# EasyEDA Pro project stm32_smart_teach.eprj

# Schematic Schematic1
Create Date: 2024-07-12; Page Name: P1; Project Name: stm32_smart_teach; Schematic Name: Schematic1; Update Date: 2024-07-14; Company: 嘉立创EDA; Page Size: A4; Version: V1.0
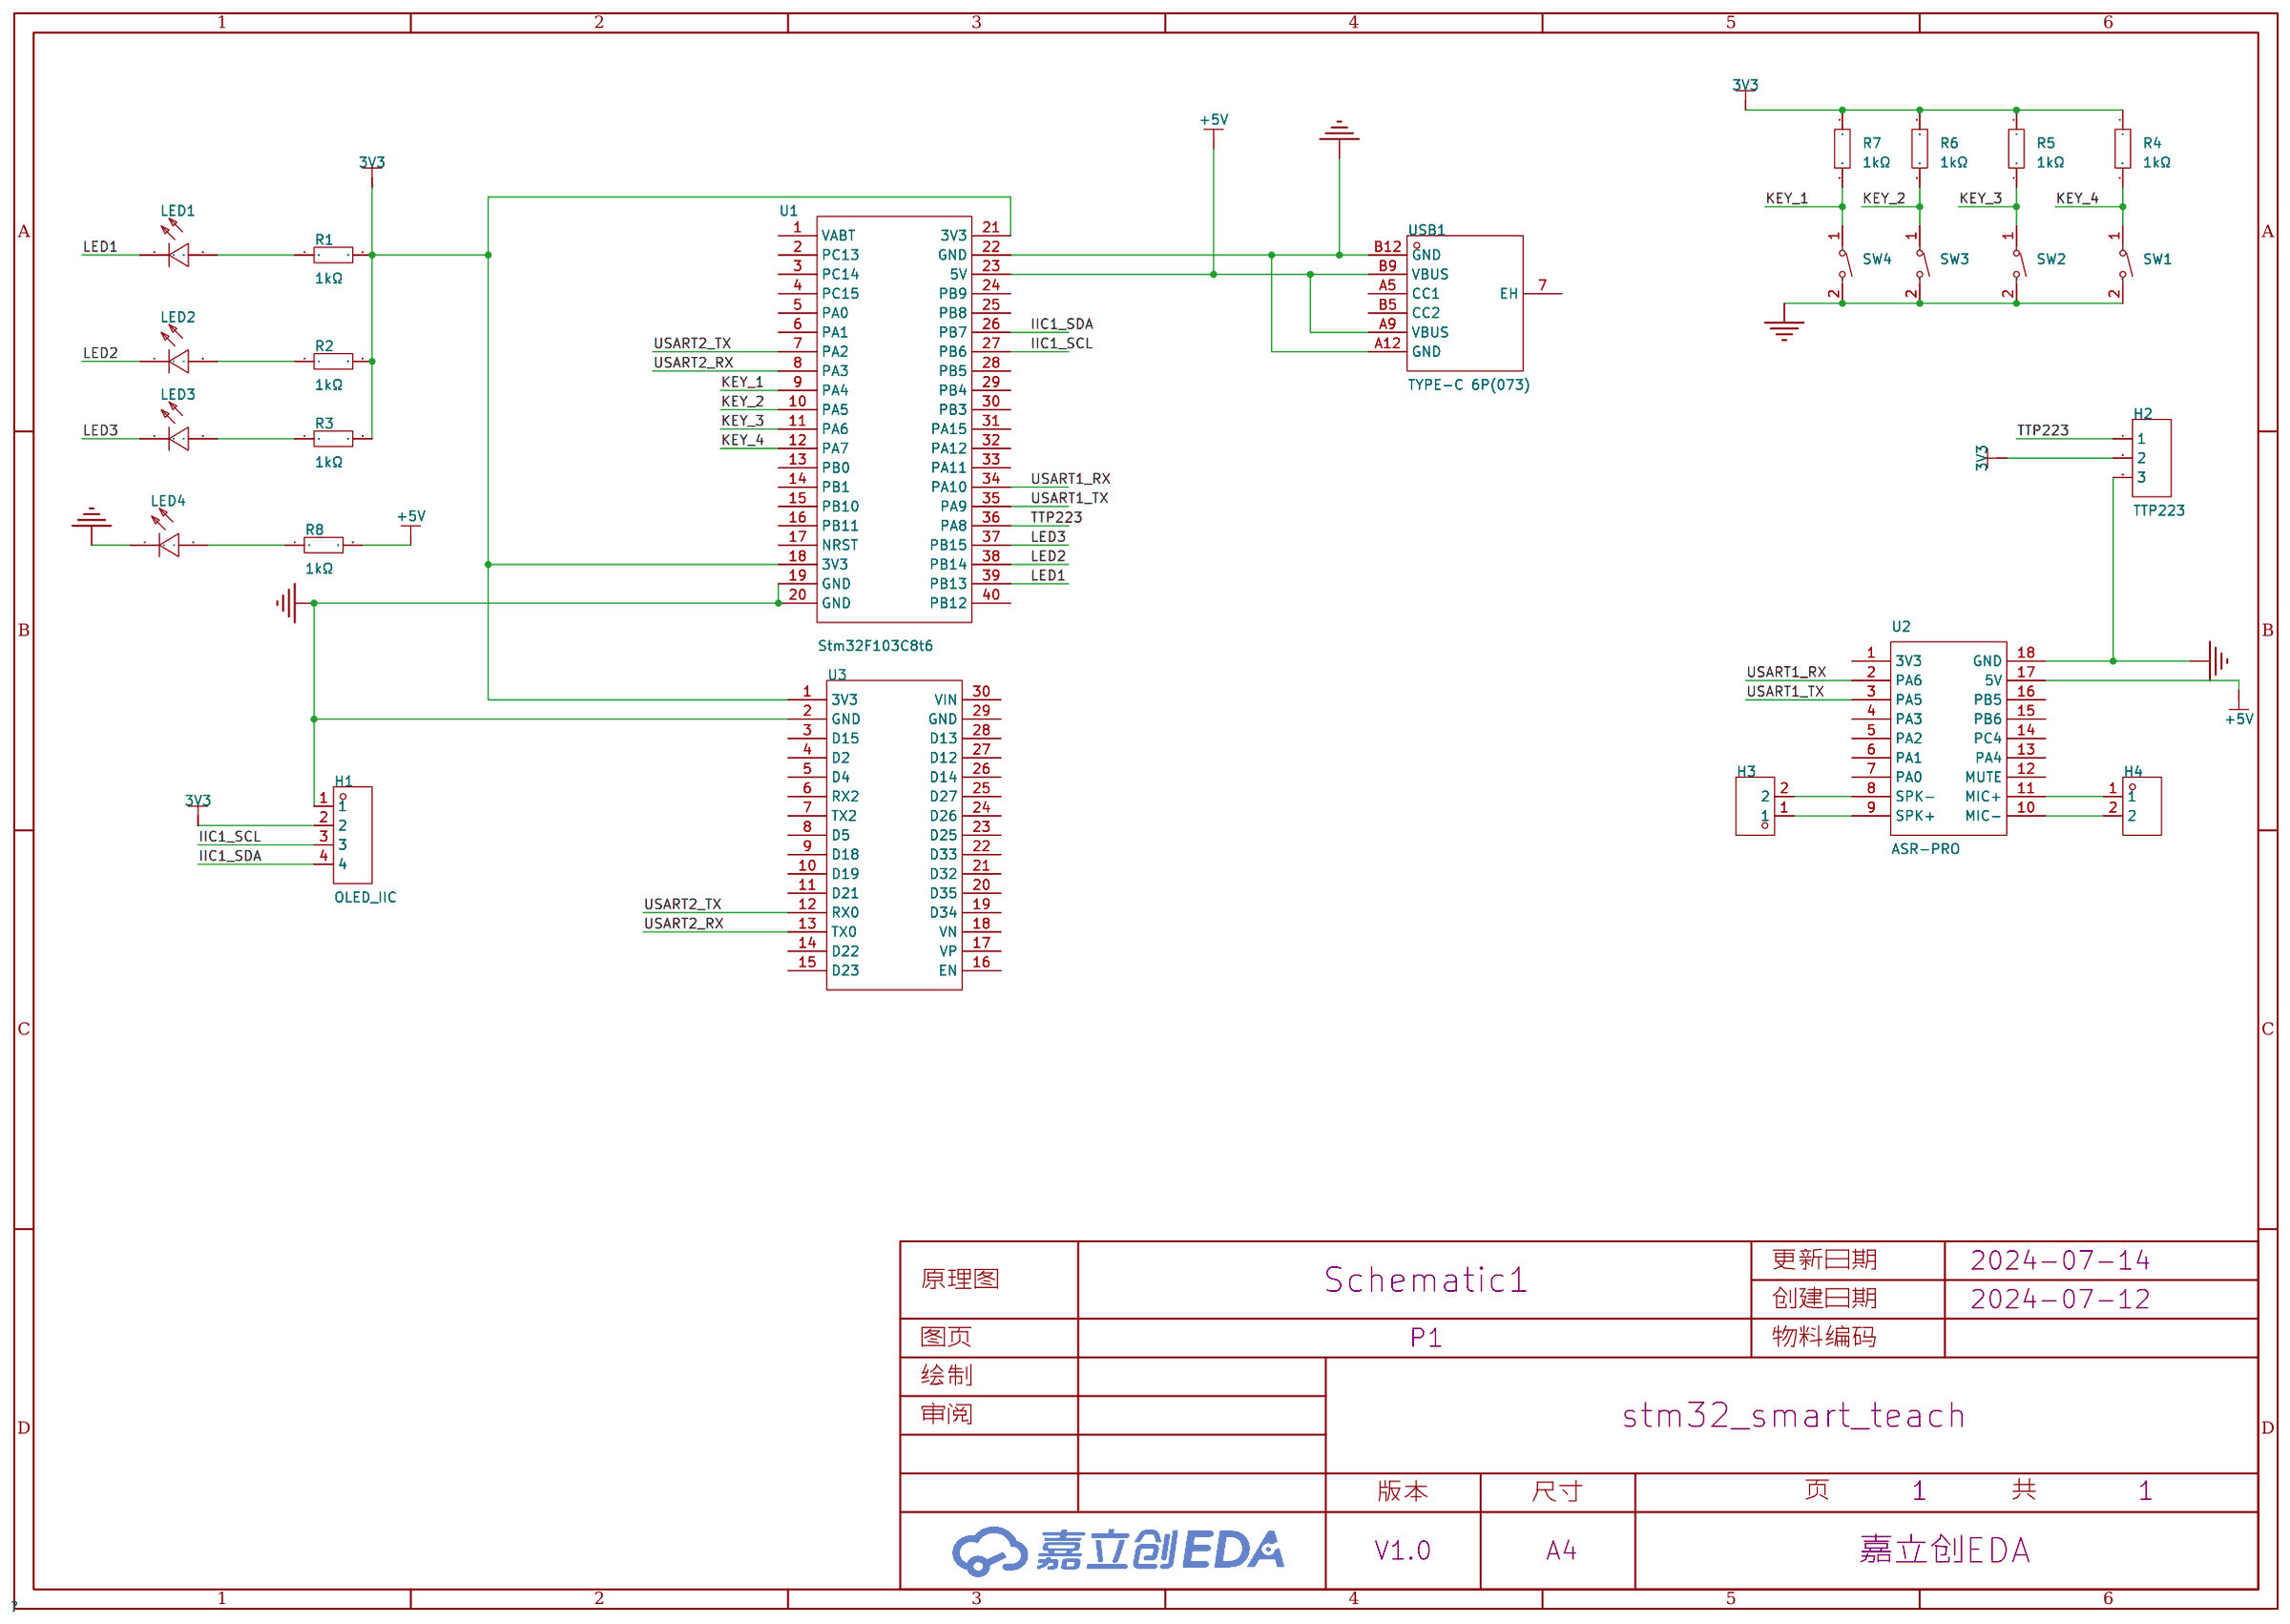
[diagram p0: schematic sheet]

## Parts
H1  OLED_IIC  [HDR-TH_4P-P2.54-V-F]
H2  TTP223  [HDR-TH_3P-P2.54-V-M-1]
H3  PZ254V-11-02P  [HDR-TH_2P-P2.54-V-M]
H4  PZ254V-11-02P  [HDR-TH_2P-P2.54-V-M]
LED1  NCD0603R1  [LED0603-RD_RED]
LED2  NCD0603R1  [LED0603-RD_RED]
LED3  NCD0603R1  [LED0603-RD]
LED4  NCD0603R1  [LED0603-RD_RED]
R1  1kΩ  [R0603]
R2  1kΩ  [R0603]
R3  1kΩ  [R0603]
R4  1kΩ  [R0603]
R5  1kΩ  [R0603]
R6  1kΩ  [R0603]
R7  1kΩ  [R0603]
R8  1kΩ  [R0603]
SW1  GT-TC060A-H025-L1S  [SW-SMD_L6.1-W3.5-LS8.0]
SW2  GT-TC060A-H025-L1S  [SW-SMD_L6.1-W3.5-LS8.0]
SW3  GT-TC060A-H025-L1S  [SW-SMD_L6.1-W3.5-LS8.0]
SW4  GT-TC060A-H025-L1S  [SW-SMD_L6.1-W3.5-LS8.0]
U1  Stm32F103C8t6  [STM32]
U2  ASR-PRO  [ASR_PRO]
U3  -  [ESP32]
USB1  TYPE-C 6P(073)  [TYPE-C-SMD_TYPE-C-6P]

## Library data of the parts
H1 = 2.54-1*4P母: 插孔结构:1x4P;间距:2.54mm;行距:-;圆孔/方孔:方孔;安装类型:直插;排数:单排;总孔位数:4P;额定电流:3A;额定电压:-;插孔方向:顶部;塑高:-;触头材质:青铜;触头镀层:-;工作温度范围:-40℃~+105℃;焊接温度(最大值):-;; LCSC Part Name: 间距:2.54mm 1x4P 直插; Supplier Part: C2718488; Manufacturer: BOOMELE(博穆精密); Supplier Footprint: 插件,P=2.54mm; JLCPCB Part Class: 扩展库; Datasheet: https://atta.szlcsc.com/upload/public/pdf/source/20210301/C2718488_F4427B881E42CAA8DDB0B1C12B3A522C.pdf; Supplier: LCSC; Holes Structure: 1x4P; Pitch: 2.54mm; Circular Hole / Square Hole: 方孔; Mounting Type: 直插; Number of Rows: 单排; Number of Holes: 4P; Current Rating (Max): 3A; Holes Direction: 顶部; Contact Material: 青铜; Operating Temperature Range: -40℃~+105℃
H2 = 2.54-1*3P针: 插针结构:1x3P;间距:2.54mm;行距:-;圆针/方针:方针;安装类型:直插;排数:单排;总PIN位数:3P;额定电流:3A;额定电压:-;配合针长度:-;塑高:-;端接针长度:-;触头材质:-;触头镀层:-;工作温度范围:-40℃~+105℃;颜色:黑色;; LCSC Part Name: 间距:2.54mm 1x3P 直插 方针; Supplier Part: C49257; Manufacturer: BOOMELE(博穆精密); Supplier Footprint: 插件,P=2.54mm; JLCPCB Part Class: 扩展库; Datasheet: https://atta.szlcsc.com/upload/public/pdf/source/20221018/3E9408392E35E6F57A28985E5F7BF5C9.pdf; Supplier: LCSC; Pin Structure: 1x3P; Pitch: 2.54mm; Circluar Pins/Square Pins: 方针; Mounting Type: 直插; Number of Rows: 单排; Number of Pins: 3P; Current Rating (Max): 3A; Operating Temperature Range: -40℃~+105℃; Color: 黑色
H3 H4 = PZ254V-11-02P: 插针结构:1x2P;间距:2.54mm;行距:-;圆针/方针:方针;安装类型:直插;排数:单排;总PIN位数:2P;额定电流:-;额定电压:-;配合针长度:6mm;塑高:2.5mm;端接针长度:3mm;触头材质:黄铜;触头镀层:-;工作温度范围:-40℃~+105℃;颜色:黑色;; LCSC Part Name: 间距:2.54mm 1x2P 直插 方针; Supplier Part: C492401; Manufacturer: XFCN(兴飞); Supplier Footprint: 插件,P=2.54mm; JLCPCB Part Class: 扩展库; Datasheet: https://atta.szlcsc.com/upload/public/pdf/source/20200309/C492401_A812433581A9B211A7FFA413ADDFF0E5.pdf; Supplier: LCSC; Pin Structure: 1x2P; Pitch: 2.54mm; Circluar Pins/Square Pins: 方针; Mounting Type: 直插; Number of Rows: 单排; Number of Pins: 2P; Length of Mating Pin: 6mm; Insulation Height: 2.5mm; Length of End Connection Pin: 3mm; Contact Material: 黄铜; Operating Temperature Range: -40℃~+105℃; Color: 黑色
LED1-LED4 = NCD0603R1_C84263: 灯头类型:-;发光颜色:红色;正向电压(VF):1.6V~2.6V;功率:65mW;正向电流:20mA;主波长:615nm~630nm;二极管配置:独立二极管;透镜颜色:无色透明透镜;色温:-;发光强度:80mcd~220mcd;发光角度:130°;载带方式:-;工作温度:-30℃~+85℃;; Supplier Part: C84263; Manufacturer: 国星光电; Supplier Footprint: 0603; JLCPCB Part Class: 扩展库; Datasheet: https://atta.szlcsc.com/upload/public/pdf/source/20200820/C84263_DABC6A75E58F576973B407FDBA283D60.pdf; Supplier: LCSC; Emitted Color: 红色; Forward Voltage (VF): 1.6V~2.6V; Power Dissipation: 65mW; Forward Current: 20mA; Dominant Wavelength: 615nm~630nm; Diode Configuration: 独立二极管; Lens Color: 无色透明透镜; Luminous Intensity: 80mcd~220mcd; Viewing Angle: 130°; Operating Temperature: -30℃~+85℃
R1-R8 = 0603WAF1001T5E: 电阻类型:厚膜电阻;阻值:1kΩ;精度:±1%;功率:100mW;最大工作电压:75V;温度系数:±100ppm/℃;; LCSC Part Name: 1kΩ ±1% 100mW 厚膜电阻; Supplier Part: C21190; Manufacturer: UNI-ROYAL(厚声); Supplier Footprint: 0603; JLCPCB Part Class: 基础库; Datasheet: https://atta.szlcsc.com/upload/public/pdf/source/20200306/C422600_1E6D84923E4A46A82E41ADD87F860B5C.pdf; Supplier: LCSC; Type: 厚膜电阻; Tolerance: ±1%; Power(Watts): 100mW; Overload Voltage (Max): 75V; Temperature Coefficient: ±100ppm/℃; Operating Temperature Range: -55℃~+155℃
SW1-SW4 = GT-TC060A-H025-L1S: 电路结构:单刀单掷;作用力:1.6N;安装方式:立贴;带支架:不带;触点电流:50mA;额定电压(AC):12V;额定电压(DC):12V;绝缘电阻:100MΩ;带灯:无;机械寿命:10万次;; LCSC Part Name: 3×6×2.5 立贴 无声轻触开关; Supplier Part: C7450623; Manufacturer: G-Switch(品赞); Supplier Footprint: SMD,3x6mm; JLCPCB Part Class: 扩展库; Datasheet: https://atta.szlcsc.com/upload/public/pdf/source/20230712/3FF422A4BEDB42853830040444FDF292.pdf; Supplier: LCSC; Circuit: 单刀单掷; Operating Force: 1.6N; Mounting Style: 立贴; Strike Gundam: 不带; Contact Current: 50mA; Voltage Rating (AC): 12V; Voltage Rating (DC): 12V; Insulation Resistance: 100MΩ; With Lamp: 无; Mechanical Life: 10万次
U1 = stm32f103c8t6
U2 = ASR-PRO
U3 = esp32
USB1 = TYPE-C 6P(073): 连接器类型:Type-C;标准:-;公母:母;端口数量:1;触点数量:6P;安装方式:卧贴;额定电流 - 电源:5A;工作温度范围:-25℃~+85℃;; LCSC Part Name: Type-C 母 卧贴; Supplier Part: C668623; Manufacturer: SHOU HAN(首韩); Supplier Footprint: SMD; JLCPCB Part Class: 扩展库; Datasheet: https://atta.szlcsc.com/upload/public/pdf/source/20200618/C668623_A4B260DED7AC1949BAC6AE39E9F4CD80.pdf; Supplier: LCSC; Connector Type: Type-C; Gender: 母; Number of Ports: 1; Number of Contacts: 6P; Mounting Style: 卧贴; Current Rating - Power (Max): 5A; Operating Temperature Range: -25℃~+85℃

## Nets
3V3: H1.2 H2.2 R1.2 R2.2 R3.2 R4.1 R5.1 R6.1 R7.1 U1.18(3V3) U1.21(3V3) U3.1(3V3)
+5V: R8.2 U1.23(5V) U2.17(5V) USB1.A9(VBUS) USB1.B9(VBUS)
GND: H1.1 H2.3 LED4.1(K) SW1.2 SW2.2 SW3.2 SW4.2 U1.19(GND) U1.20(GND) U1.22(GND) U2.18(GND) U3.2(GND) USB1.A12(GND) USB1.B12(GND)
IIC1_SCL: H1.3 U1.27(PB6)
IIC1_SDA: H1.4 U1.26(PB7)
KEY_1: R7.2 SW4.1 U1.9(PA4)
KEY_2: R6.2 SW3.1 U1.10(PA5)
KEY_3: R5.2 SW2.1 U1.11(PA6)
KEY_4: R4.2 SW1.1 U1.12(PA7)
LED1: LED1.1(K) U1.39(PB13)
LED2: LED2.1(K) U1.38(PB14)
LED3: LED3.1(K) U1.37(PB15)
TTP223: H2.1 U1.36(PA8)
USART1_RX: U1.34(PA10) U2.2(PA6)
USART1_TX: U1.35(PA9) U2.3(PA5)
USART2_RX: U1.8(PA3) U3.13(TX0)
USART2_TX: U1.7(PA2) U3.12(RX0)
$1N2467: LED3.2(A) R3.1
$1N2473: LED2.2(A) R2.1
$1N2476: LED1.2(A) R1.1
$1N2645: LED4.2(A) R8.1
$1N3437: H4.2 U2.10(MIC-)
$1N3440: H4.1 U2.11(MIC+)
$1N3443: H3.1 U2.9(SPK+)
$1N3451: H3.2 U2.8(SPK-)

Not connected (* = marked no-connect by the designer): U1 1(VABT) 2(PC13) 3(PC14) 4(PC15) 5(PA0) 6(PA1) 13(PB0) 14(PB1) 15(PB10) 16(PB11) 17(NRST) 24(PB9) 25(PB8) 28(PB5) 29(PB4) 30(PB3) 31(PA15) 32(PA12) 33(PA11) 40(PB12); U2 1(3V3) 4(PA3) 5(PA2) 6(PA1) 7(PA0) 12(MUTE) 13(PA4) 14(PC4) 15(PB6) 16(PB5); U3 3(D15) 4(D2) 5(D4) 6(RX2) 7(TX2) 8(D5) 9(D18) 10(D19) 11(D21) 14(D22) 15(D23) 16(EN) 17(VP) 18(VN) 19(D34) 20(D35) 21(D32) 22(D33) 23(D25) 24(D26) 25(D27) 26(D14) 27(D12) 28(D13) 29(GND) 30(VIN); USB1 7(EH) A5(CC1) B5(CC2)

# Board PCB1
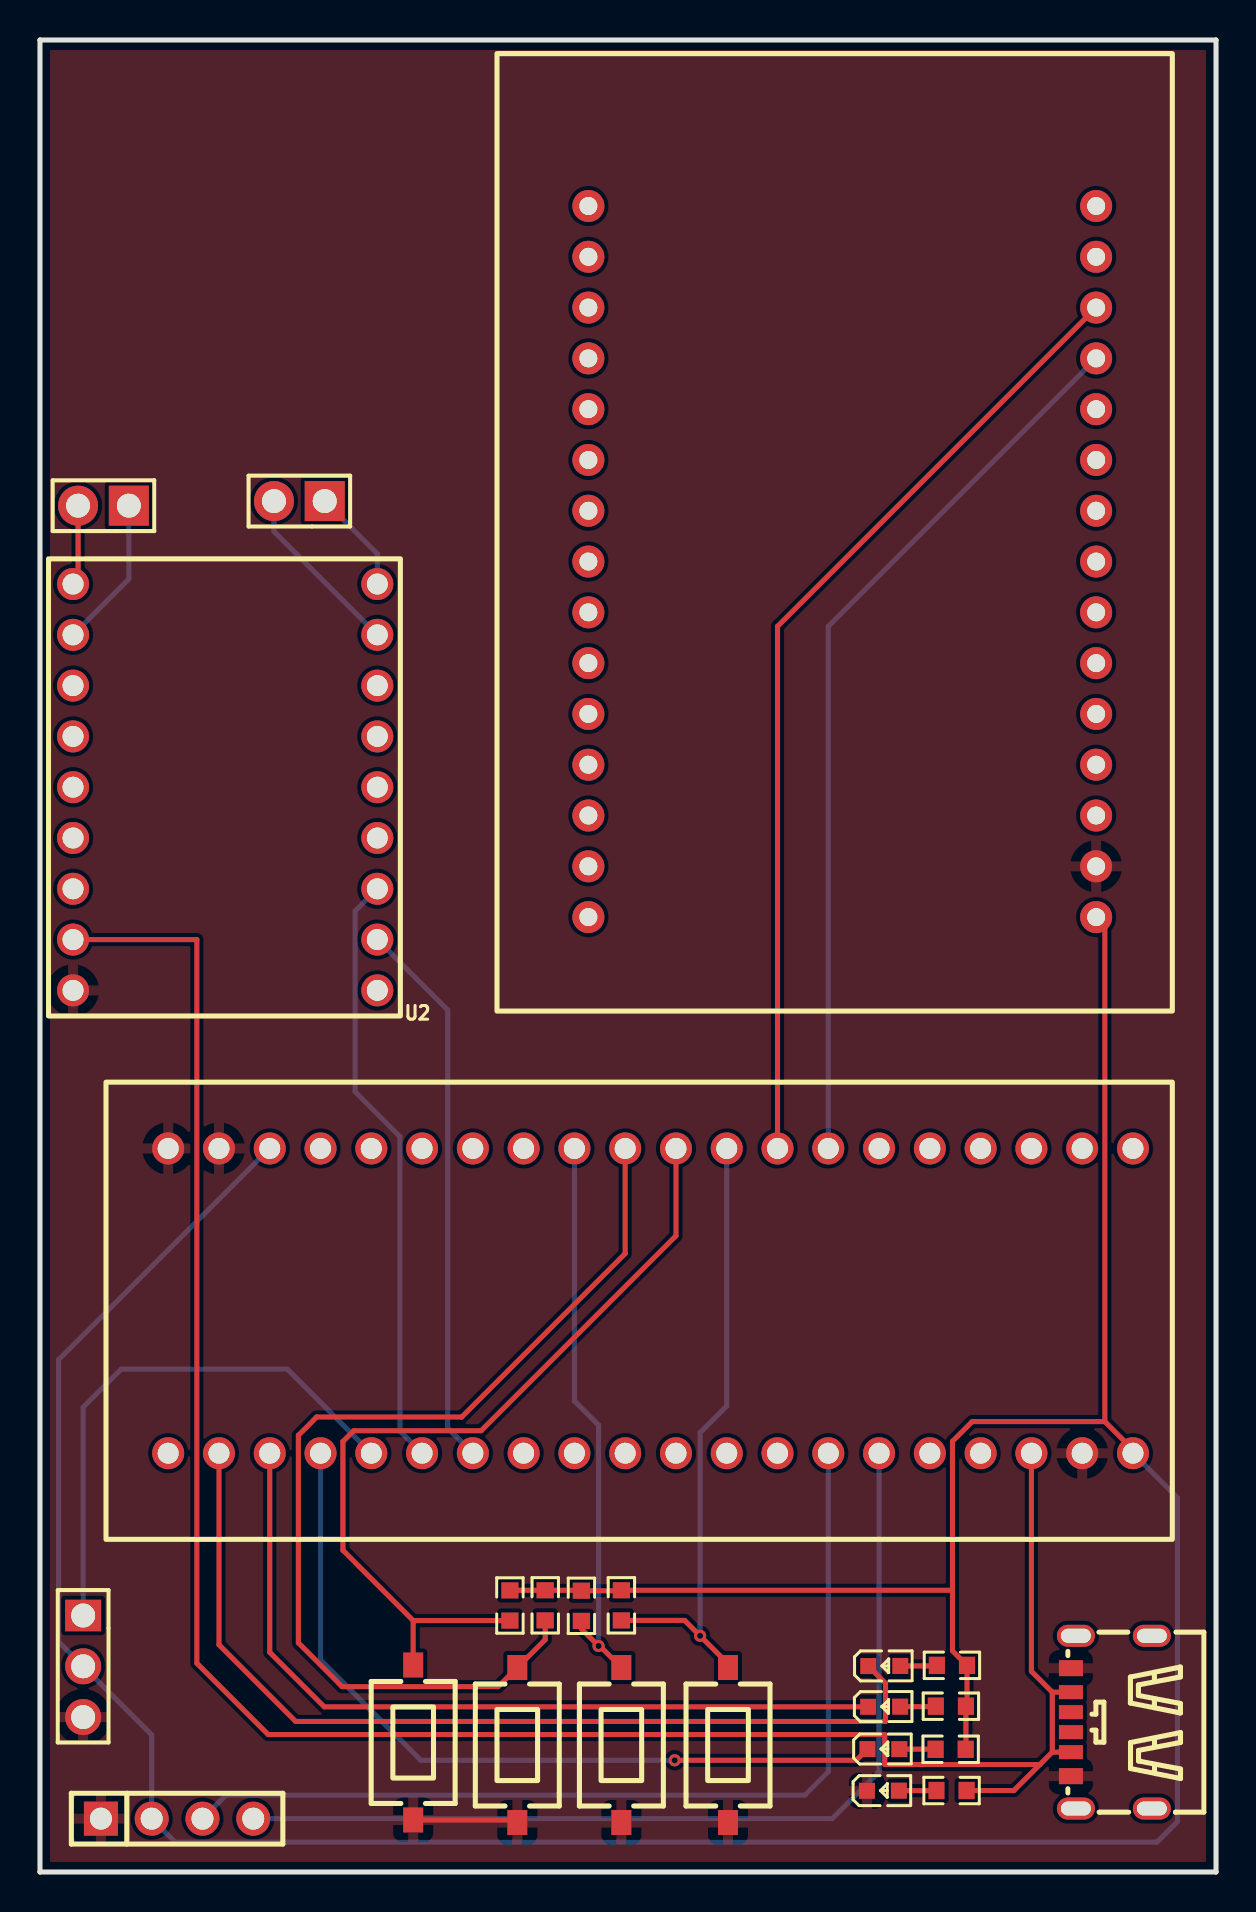
[diagram p1: board, top side]
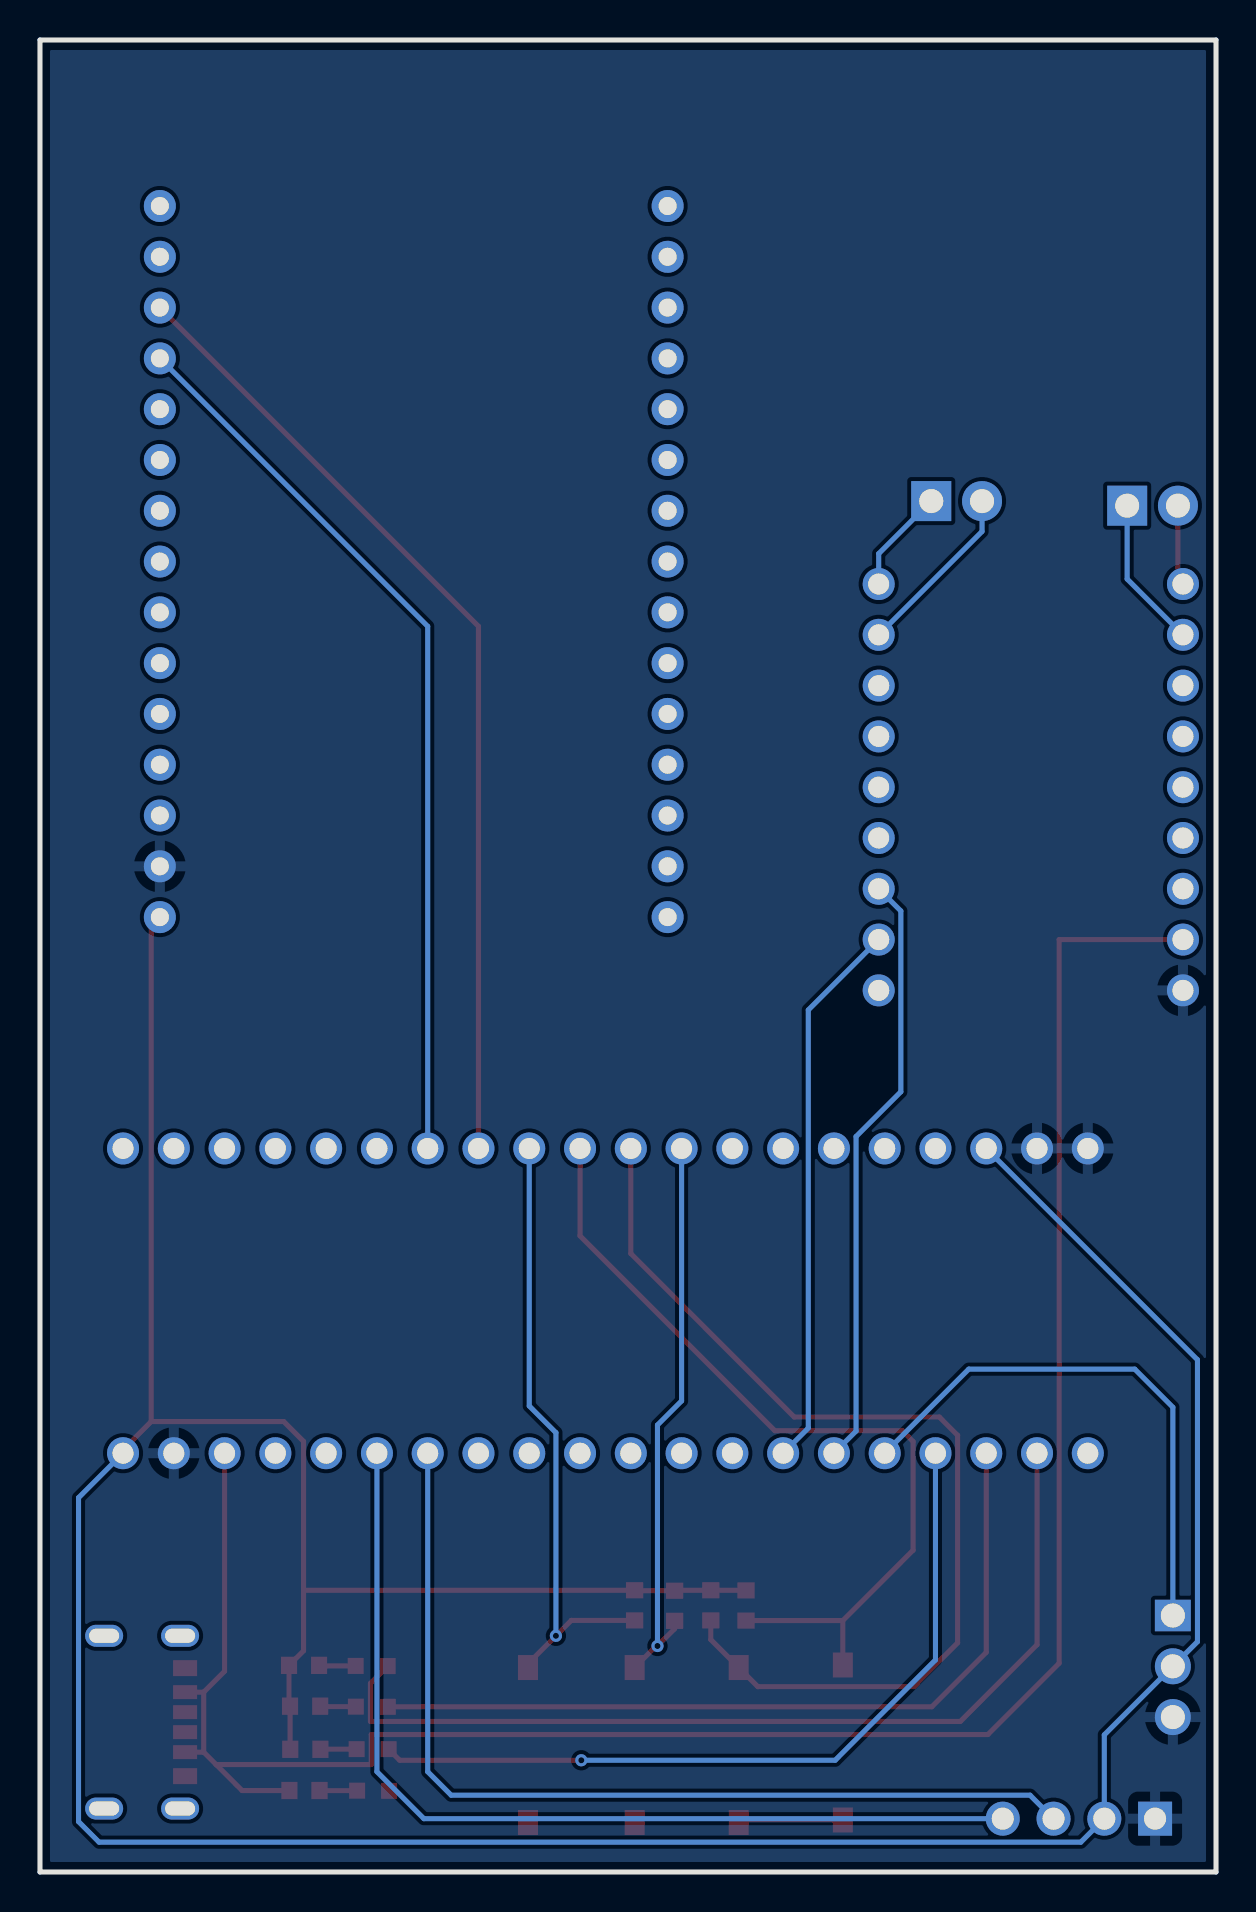
[diagram p2: board, bottom side, seen from below]

Outline 58.83 x 91.61 mm; copper layers: Top Layer, Bottom Layer. Coordinates in mm from the lower left corner of the outline.
Outline path: 0,91.61 58.83,91.61 58.83,0 0,0 0,91.61
Stack: Top Layer 0.035mm / Dielectric1 1.51mm FR4 er 4.5 / Bottom Layer 0.035mm

## Design rules (mm)
template: JLCPCB Capability(Two Layers Board)
spacing copperThickness1oz (default): track to track 0.102, other pairs 0.152 to 0.3
spacing copperThickness2oz: track to track 0.203, other pairs 0.152 to 0.3
track width copperThickness1oz (default): min 0.127, default 0.254, max 2.54
track width copperThickness2oz: min 0.203, default 0.254, max 2.54
differential pair differentialPair (default): width min 0.127, default 0.254, max 2.54; gap min 0.152, default 0.152
via viaSize (default): diameter min 0.5, default 0.61, max 10; hole min 0.3, default 0.305, max 6.3

## Placement (name value [footprint] x y rotation side)
H1  OLED_IIC  [HDR-TH_4P-P2.54-V-F]  6.86 2.67 0 top
H2  TTP223  [HDR-TH_3P-P2.54-V-M-1]  2.16 10.29 270 top
H3  PZ254V-11-02P  [HDR-TH_2P-P2.54-V-M]  12.97 68.56 180 top
H4  PZ254V-11-02P  [HDR-TH_2P-P2.54-V-M]  3.17 68.33 180 top
LED1  NCD0603R1  [LED0603-RD_RED]  42.23 10.3 0 top
LED2  NCD0603R1  [LED0603-RD_RED]  42.23 8.27 0 top
LED3  NCD0603R1  [LED0603-RD]  42.19 6.14 0 top
LED4  NCD0603R1  [LED0603-RD_RED]  42.16 4.06 0 top
R1  1kΩ  [R0603]  45.62 10.33 0 top
R2  1kΩ  [R0603]  45.57 8.29 0 top
R3  1kΩ  [R0603]  45.55 6.14 0 top
R4  1kΩ  [R0603]  27.08 13.31 270 top
R5  1kΩ  [R0603]  25.27 13.34 270 top
R6  1kΩ  [R0603]  23.51 13.33 270 top
R7  1kΩ  [R0603]  29.08 13.34 270 top
R8  1kΩ  [R0603]  45.6 4.07 0 top
SW1  GT-TC060A-H025-L1S  [SW-SMD_L6.1-W3.5-LS8.0]  29.08 6.35 270 top
SW2  GT-TC060A-H025-L1S  [SW-SMD_L6.1-W3.5-LS8.0]  23.88 6.35 270 top
SW3  GT-TC060A-H025-L1S  [SW-SMD_L6.1-W3.5-LS8.0]  18.67 6.48 270 top
SW4  GT-TC060A-H025-L1S  [SW-SMD_L6.1-W3.5-LS8.0]  34.42 6.35 270 top
U1  Stm32F103C8t6  [STM32]  56.77 39.5 270 top
U2  ASR-PRO  [ASR_PRO]  9.23 53.72 180 top
U3  -  [ESP32]  40.13 65.53 180 top
USB1  TYPE-C 6P(073)  [TYPE-C-SMD_TYPE-C-6P]  53.59 7.49 90 top

## Footprints (pads in the part's own frame, mm; a bottom-side part is the same pattern mirrored in y, then rotated)
ASR_PRO
  round 1.6 hole 1.05: 1(-7.647,9.637) 2(-7.647,7.097) 3(-7.647,4.557) 4(-7.647,2.017) 5(-7.647,-0.523) 6(-7.647,-3.063) 7(-7.647,-5.603) 8(-7.647,-8.143) 9(-7.647,-10.683) 10(7.573,-10.683) 11(7.573,-8.143) 12(7.573,-5.603) 13(7.573,-3.063) 14(7.573,-0.523) 15(7.573,2.017) 16(7.573,4.557) 17(7.573,7.097) 18(7.573,9.637)
ESP32
  round 1.6 hole 0.9: 1(-12.7,17.78) 2(-12.7,15.24) 3(-12.7,12.7) 4(-12.7,10.16) 5(-12.7,7.62) 6(-12.7,5.08) 7(-12.7,2.54) 8(-12.7,0) 9(-12.7,-2.54) 10(-12.7,-5.08) 11(-12.7,-7.62) 12(-12.7,-10.16) 13(-12.7,-12.7) 14(-12.7,-15.24) 15(-12.7,-17.78) 16(12.7,-17.78) 17(12.7,-15.24) 18(12.7,-12.7) 19(12.7,-10.16) 20(12.7,-7.62) 21(12.7,-5.08) 22(12.7,-2.54) 23(12.7,0) 24(12.7,2.54) 25(12.7,5.08) 26(12.7,7.62) 27(12.7,10.16) 28(12.7,12.7) 29(12.7,15.24) 30(12.7,17.78)
HDR-TH_2P-P2.54-V-M
  rect 2x2 hole 1.2: 1(-1.27,0)
  round 2 hole 1.2: 2(1.27,0)
HDR-TH_3P-P2.54-V-M-1
  rect 1.575x1.8 hole 1.2: 1(-2.54,0)
  round 1.8 hole 1.2: 2(0,0) 3(2.54,0)
HDR-TH_4P-P2.54-V-F
  rect 1.7x1.7 hole 1.1: 1(-3.81,0)
  round 1.7 hole 1.1: 2(-1.27,0) 3(1.27,0) 4(3.81,0)
LED0603-RD
  rect 0.8x0.8 smd: 1(-0.799,0) 2(0.799,0)
LED0603-RD_RED
  rect 0.8x0.8 smd: 1(-0.799,-0.004) 2(0.799,0.004)
R0603
  rect 0.806x0.864 smd: 1(-0.753,0) 2(0.753,0)
STM32
  round 1.6 hole 1.05: 1(3.314,-2.095) 2(3.314,-4.636) 3(3.314,-7.176) 4(3.314,-9.716) 5(3.314,-12.255) 6(3.314,-14.796) 7(3.314,-17.335) 8(3.314,-19.875) 9(3.314,-22.416) 10(3.314,-24.956) 11(3.314,-27.495) 12(3.314,-30.035) 13(3.314,-32.575) 14(3.314,-35.115) 15(3.314,-37.656) 16(3.314,-40.196) 17(3.314,-42.736) 18(3.314,-45.276) 19(3.314,-47.816) 20(3.314,-50.355) 21(18.555,-2.095) 22(18.555,-4.636) 23(18.555,-7.176) 24(18.555,-9.716) 25(18.555,-12.255) 26(18.555,-14.796) 27(18.555,-17.335) 28(18.555,-19.875) 29(18.555,-22.416) 30(18.555,-24.956) 31(18.555,-27.495) 32(18.555,-30.035) 33(18.555,-32.575) 34(18.555,-35.115) 35(18.555,-37.656) 36(18.555,-40.196) 37(18.555,-42.736) 38(18.555,-45.276) 39(18.555,-47.816) 40(18.555,-50.355)
SW-SMD_L6.1-W3.5-LS8.0
  rect 1.25x1 smd: 1(-3.875,0) 2(3.875,0)
TYPE-C-SMD_TYPE-C-6P
  oval 1.1x1.9 hole 0.7x1.5: 7(-4.32,1.775) 7(-4.32,-2.025) 7(4.32,1.775) 7(4.32,-2.025)
  rect 0.7x1.2 smd: A5(-0.5,2.025) A9(1.5,2.025) B5(0.5,2.025) B9(-1.5,2.025)
  rect 0.8x1.2 smd: A12(2.7,2.025) B12(-2.7,2.025)

## Nets
As in the schematic.

Pads without a net: U1 1 2 3 4 5 6 13 14 15 16 17 24 25 28 29 30 31 32 33 40; U2 1 4 5 6 7 12 13 14 15 16; U3 3 4 5 6 7 8 9 10 11 14 15 16 17 18 19 20 21 22 23 24 25 26 27 28 29 30; USB1 7 A5 B5

## Via types
v1: diameter 0.61, hole 0.305, Top Layer to Bottom Layer, 3 vias

## Routing (per net, layer and track width the routed paths; a pad name or vN(x,y) marks a point on that pad's centre or on a via; arc(x,y) is an arc through that point)
3V3: length 184.9
  Top Layer w0.254: 53.26,22.53 53.26,47.32 U3.1 ; 53.26,22.53 46.63,22.53 45.64,21.54 45.64,14.09 ; 53.26,22.53 54.67,21.12 U1.21 ; 45.64,14.09 R7.1 29.06,14.07 R4.1 27.06,14.09 R5.1 23.52,14.09 R6.1 ; 45.64,14.09 45.64,11.06 R1.2 46.37,8.34 R2.2 46.32,6.15 R3.2
  Bottom Layer w0.254: U1.18 0.93,25.62 0.93,11.52 H2.2 5.59,6.86 H1.2 6.76,1.49 55.87,1.49 56.9,2.52 56.9,18.72 U1.21
+5V: length 109.9
  Top Layer w0.254: 50.64,5.99 50.64,8.99 ; 50.64,5.99 50.02,5.37 ; 50.64,5.99 USB1.B9 ; 50.64,8.99 49.59,10.04 U1.23 ; 50.64,8.99 USB1.A9 ; 50.02,5.37 42.26,5.37 42.26,6.88 11.41,6.88 7.85,10.44 7.85,46.63 U2.17 ; 50.02,5.37 48.72,4.07 R8.2
GND: length 5.3
  Top Layer w0.254: SW2.2 23.75,2.6 SW3.2
IIC1_SCL: length 48.2
  Bottom Layer w0.254: U1.27 39.43,5.02 38.26,3.84 9.3,3.84 H1.3
IIC1_SDA: length 48.2
  Bottom Layer w0.254: H1.4 39.62,2.67 41.97,5.02 U1.26
KEY_1: length 31.3
  Top Layer w0.254: R7.2 32.25,12.58 v1(33.02,11.81) 34.42,10.41 SW4.1
  Bottom Layer w0.254: v1(33.02,11.81) 33.02,21.97 34.35,23.3 U1.9
KEY_2: length 42.8
  Top Layer w0.254: 18.67,12.57 15.15,16.09 15.15,21.53 15.69,22.07 22.07,22.07 31.81,31.81 U1.10 ; 18.67,12.57 R6.2 ; 18.67,12.57 SW3.1
KEY_3: length 50.9
  Top Layer w0.254: U1.11 29.27,30.93 21.1,22.75 13.84,22.75 12.93,21.84 12.93,11.46 15.11,9.27 22.92,9.27 SW2.1 25.27,11.62 R5.2
KEY_4: length 28.6
  Top Layer w0.254: R4.2 27.08,12.16 v1(27.94,11.3) 28.01,11.3 SW1.1
  Bottom Layer w0.254: v1(27.94,11.3) 27.94,22.35 26.73,23.56 U1.12
LED1: length 47.6
  Top Layer w0.254: U1.39 8.95,11.37 12.79,7.53 42.3,7.53 42.3,9.44 LED1.1
LED2: length 41
  Top Layer w0.254: U1.38 11.49,10.99 14.22,8.26 LED2.1
LED3: length 40
  Top Layer w0.254: LED3.1 40.83,5.59 v1(31.75,5.59)
  Bottom Layer w0.254: U1.37 14.03,10.6 19.05,5.59 v1(31.75,5.59)
TTP223: length 27.4
  Bottom Layer w0.254: H2.1 2.16,23.24 4.06,25.15 12.37,25.15 U1.36
USART1_RX: length 27.7
  Bottom Layer w0.254: U2.2 20.39,43.11 20.39,22.2 U1.34
USART1_TX: length 30.1
  Bottom Layer w0.254: U1.35 18.01,22.05 18.01,36.78 15.77,39.02 15.77,48.06 U2.3
USART2_RX: length 48.7
  Top Layer w0.254: U3.13 36.89,62.29 U1.8
USART2_TX: length 45.1
  Bottom Layer w0.254: U3.12 39.43,62.29 U1.7
$1N2467: length 1.8
  Top Layer w0.254: R3.1 44.79,6.14 LED3.2
$1N2473: length 1.8
  Top Layer w0.254: LED2.2 44.79,8.27 R2.1
$1N2476: length 1.8
  Top Layer w0.254: R1.1 44.84,10.31 LED1.2
$1N2645: length 1.9
  Top Layer w0.254: LED4.2 44.84,4.07 R8.1
$1N3437: length 4
  Top Layer w0.254: U2.10 1.91,64.66 H4.2
$1N3440: length 7.6
  Bottom Layer w0.254: U2.11 4.44,64.66 H4.1
$1N3443: length 5.2
  Bottom Layer w0.254: U2.9 16.87,65.93 H3.1
$1N3451: length 8.8
  Bottom Layer w0.254: H3.2 11.7,67.04 U2.8

## Copper pours and planes (outline as drawn; the poured copper is in the pictures)
GND on Top Layer: 0,91.61 58.83,91.61 58.83,0 0,0
GND on Bottom Layer: 0,91.61 58.83,91.61 58.83,0 0,0
